# EAGLE design KeyboardSidepanel (EAGLE 7.7.0)
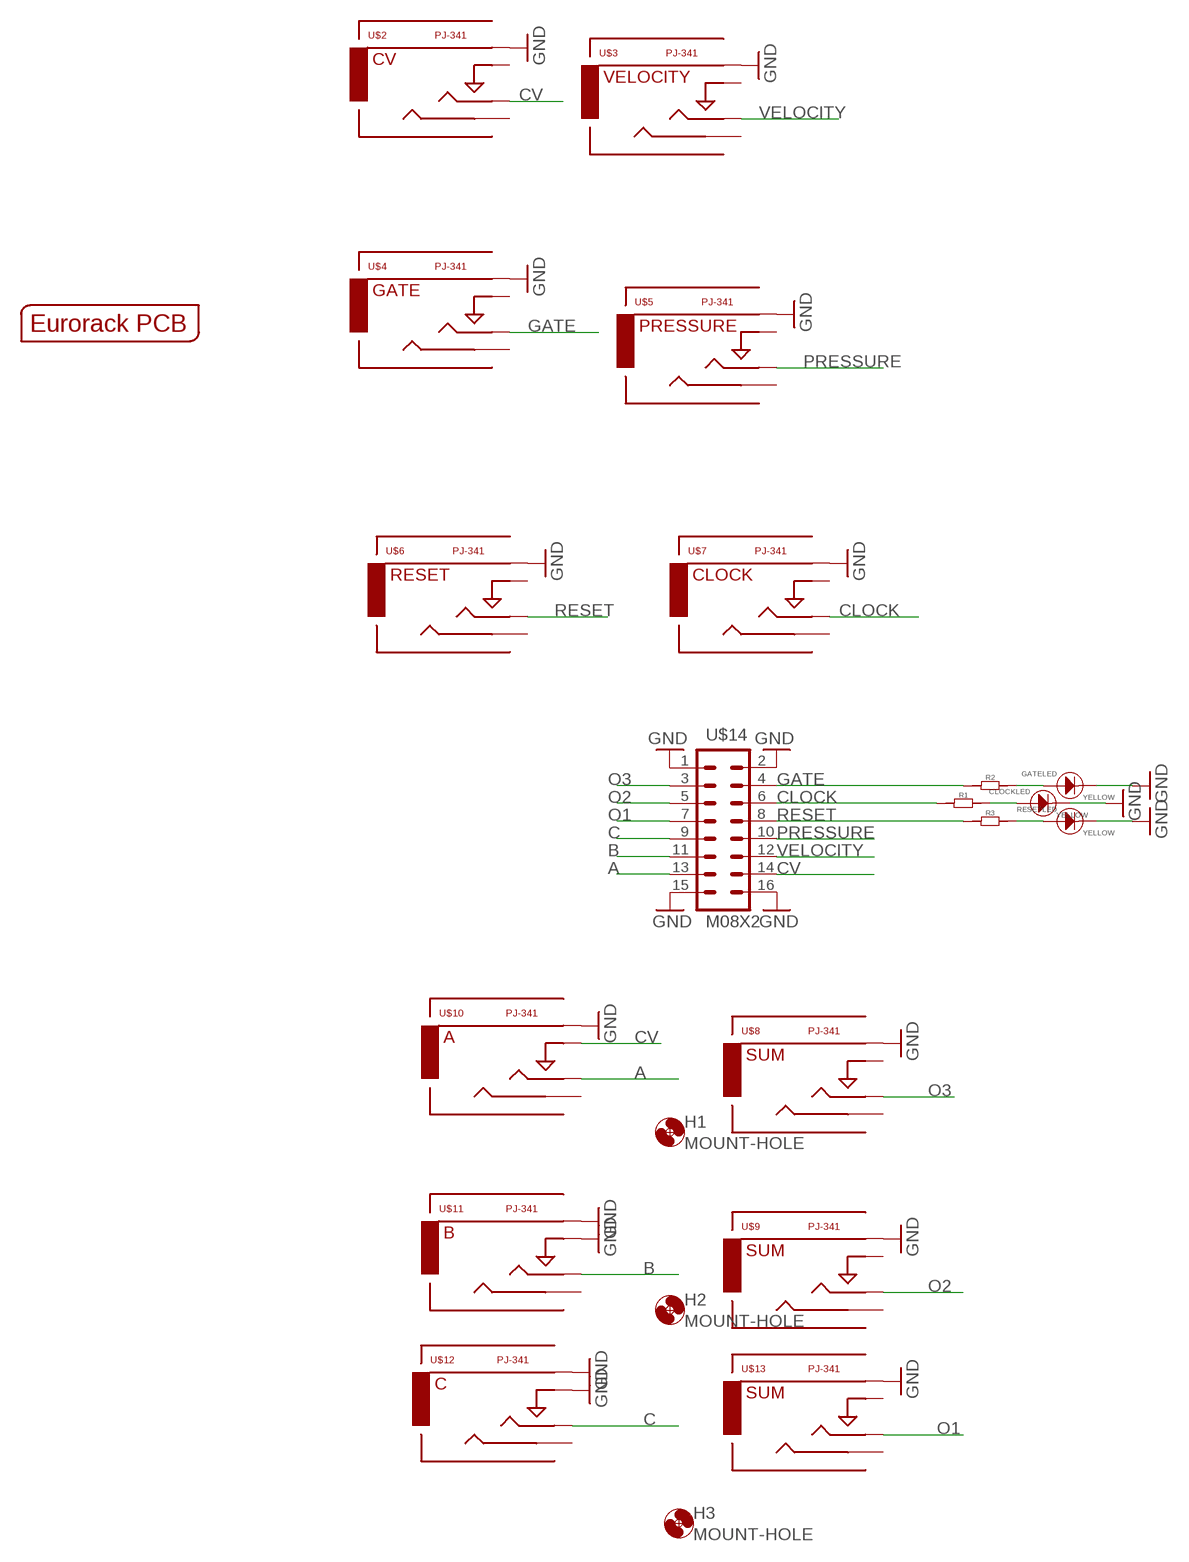
[diagram p0: schematic, sheet 1]

## Parts
CLOCKLED  YELLOW  LED3MM  [3MMLED]
GATELED  YELLOW  LED3MM  [3MMLED]
H1  MOUNT-HOLE  [3.2-NOMARKINGS-SMALLSAFEZONE]
H2  MOUNT-HOLE  [3.2-NOMARKINGS-SMALLSAFEZONE]
H3  MOUNT-HOLE  [3.2-NOMARKINGS-SMALLSAFEZONE]
R1  R-0603  [R0603]
R2  R-0603  [R0603]
R3  R-0603  [R0603]
RESETLED  YELLOW  LED3MM  [3MMLED]
U$1  EURORACK_PCB6HP_10CM  [EURORACK6HPPCB_10CMTALL]
U$2  PJ-341  AUDIO-JACKOUTPUT  [3.5MM-JACK-SWITCH-13MM-OUTPUT]
U$3  PJ-341  AUDIO-JACKOUTPUT  [3.5MM-JACK-SWITCH-13MM-OUTPUT]
U$4  PJ-341  AUDIO-JACKOUTPUT  [3.5MM-JACK-SWITCH-13MM-OUTPUT]
U$5  PJ-341  AUDIO-JACKOUTPUT  [3.5MM-JACK-SWITCH-13MM-OUTPUT]
U$6  PJ-341  AUDIO-JACKOUTPUT  [3.5MM-JACK-SWITCH-13MM-OUTPUT]
U$7  PJ-341  AUDIO-JACKOUTPUT  [3.5MM-JACK-SWITCH-13MM-OUTPUT]
U$8  PJ-341  AUDIO-JACKOUTPUT  [3.5MM-JACK-SWITCH-13MM-OUTPUT]
U$9  PJ-341  AUDIO-JACKOUTPUT  [3.5MM-JACK-SWITCH-13MM-OUTPUT]
U$10  PJ-341  AUDIO-JACKINPUT  [3.5MM-JACK-SWITCH-13MM-INPUT]
U$11  PJ-341  AUDIO-JACKINPUT  [3.5MM-JACK-SWITCH-13MM-INPUT]
U$12  PJ-341  AUDIO-JACKINPUT  [3.5MM-JACK-SWITCH-13MM-INPUT]
U$13  PJ-341  AUDIO-JACKOUTPUT  [3.5MM-JACK-SWITCH-13MM-OUTPUT]
U$14  M08X2  [2X8]

## Nets
A: U$10.TIP@3(TIP) U$14.13
B: U$11.TIP@3(TIP) U$14.11
C: U$12.TIP@3(TIP) U$14.9
CLOCK: R1.1 U$7.TIP@3(TIP) U$14.6
CV: U$2.TIP@3(TIP) U$10.SWITCH@3(SWITCH) U$14.14
GATE: R2.1 U$4.TIP@3(TIP) U$14.4
GND: CLOCKLED.- GATELED.- RESETLED.- U$2.RING@3(RING) U$3.RING@3(RING) U$4.RING@3(RING) U$5.RING@3(RING) U$6.RING@3(RING) U$7.RING@3(RING) U$8.RING@3(RING) U$9.RING@3(RING) U$10.RING@3(RING) U$11.RING@3(RING) U$11.SWITCH@3(SWITCH) U$12.RING@3(RING) U$12.SWITCH@3(SWITCH) U$13.RING@3(RING) U$14.1 U$14.2 U$14.15 U$14.16
N$1: GATELED.+ R2.2
N$2: CLOCKLED.+ R1.2
N$3: R3.2 RESETLED.+
O1: U$13.TIP@3(TIP) U$14.7
O2: U$9.TIP@3(TIP) U$14.5
O3: U$8.TIP@3(TIP) U$14.3
PRESSURE: U$5.TIP@3(TIP) U$14.10
RESET: R3.1 U$6.TIP@3(TIP) U$14.8
VELOCITY: U$3.TIP@3(TIP) U$14.12
Unconnected: U$2.SECOND@3(SECOND) U$2.SWITCH@3(SWITCH) U$3.SECOND@3(SECOND) U$3.SWITCH@3(SWITCH) U$4.SECOND@3(SECOND) U$4.SWITCH@3(SWITCH) U$5.SECOND@3(SECOND) U$5.SWITCH@3(SWITCH) U$6.SECOND@3(SECOND) U$6.SWITCH@3(SWITCH) U$7.SECOND@3(SECOND) U$7.SWITCH@3(SWITCH) U$8.SECOND@3(SECOND) U$8.SWITCH@3(SWITCH) U$9.SECOND@3(SECOND) U$9.SWITCH@3(SWITCH) U$10.SECOND@3(SECOND) U$11.SECOND@3(SECOND) U$12.SECOND@3(SECOND) U$13.SECOND@3(SECOND) U$13.SWITCH@3(SWITCH)

## Library data of the parts
CLOCKLED GATELED RESETLED = EurorackModularParts:LED*: LED
H1-H3 = zephod-components:MOUNT-HOLE: MOUNTING HOLE with drill center marker
R1-R3 = OPL:R*
U$1 = EurorackModularParts:EURORACK_PCB
U$2 = EurorackModularParts:AUDIO-JACK: Switching Mono 3.5mm Audio Jack from Erthenvar.; DESC: CV; MPN: PJ-341
U$3 = EurorackModularParts:AUDIO-JACK: Switching Mono 3.5mm Audio Jack from Erthenvar.; DESC: VELOCITY; MPN: PJ-341
U$4 = EurorackModularParts:AUDIO-JACK: Switching Mono 3.5mm Audio Jack from Erthenvar.; DESC: GATE; MPN: PJ-341
U$5 = EurorackModularParts:AUDIO-JACK: Switching Mono 3.5mm Audio Jack from Erthenvar.; DESC: PRESSURE; MPN: PJ-341
U$6 = EurorackModularParts:AUDIO-JACK: Switching Mono 3.5mm Audio Jack from Erthenvar.; DESC: RESET; MPN: PJ-341
U$7 = EurorackModularParts:AUDIO-JACK: Switching Mono 3.5mm Audio Jack from Erthenvar.; DESC: CLOCK; MPN: PJ-341
U$8 U$9 U$13 = EurorackModularParts:AUDIO-JACK: Switching Mono 3.5mm Audio Jack from Erthenvar.; DESC: SUM; MPN: PJ-341
U$10 = EurorackModularParts:AUDIO-JACK: Switching Mono 3.5mm Audio Jack from Erthenvar.; DESC: A; MPN: PJ-341
U$11 = EurorackModularParts:AUDIO-JACK: Switching Mono 3.5mm Audio Jack from Erthenvar.; DESC: B; MPN: PJ-341
U$12 = EurorackModularParts:AUDIO-JACK: Switching Mono 3.5mm Audio Jack from Erthenvar.; DESC: C; MPN: PJ-341
U$14 = SparkFun-Connectors:M08X2: .1" headers, two rows of 8 each

## Net classes
0 default: width 0.254 mm

## Board
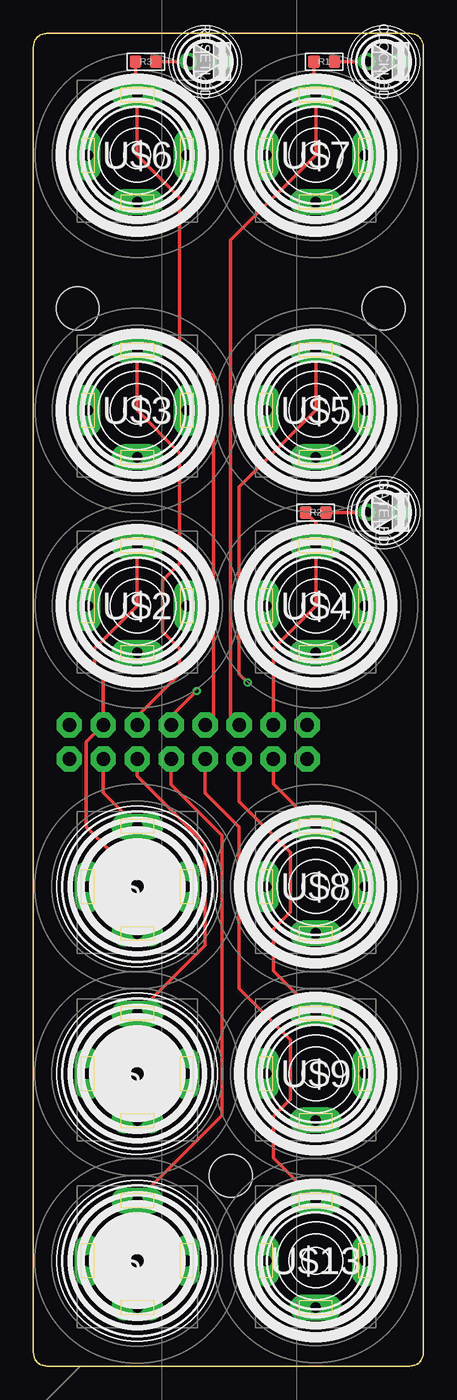
[diagram p1: board, top side]
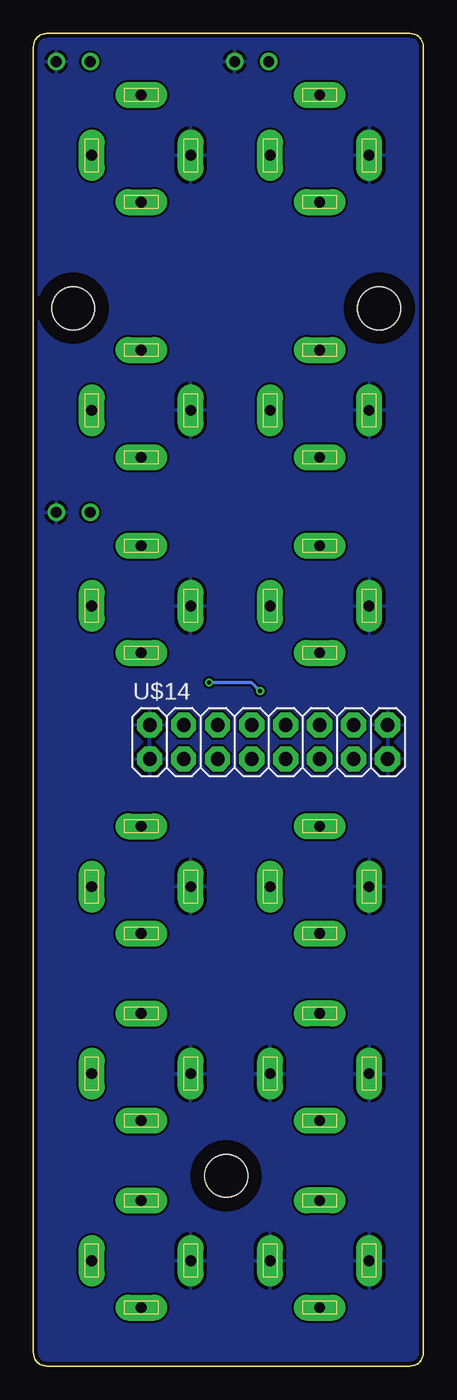
[diagram p2: board, bottom side, seen from below]

Size 29.14 x 99.5 mm. Coordinates in mm from the lower left corner, seen from the top.
Copper layers (1*16): Top 0.035mm / dielectric 1.5mm / Bottom 0.035mm
Design rules "ITEADstudio_DRC": minimum track width 6mil, minimum drill 12mil, track to track 6mil, track to pad 6mil, pad to pad 6mil, via to via 6mil, smd to smd 0mil, copper to edge 10mil, drill to drill 10mil, minimum pad ring 10mil, minimum via ring 6mil, stop-mask expansion 2mil, vias tented up to drill 100mil, thermal gap 10mil

### Footprints (pad centres in the part's own frame; a part is rotated, then mirrored left to right if it is on the bottom)
3MMLED = drill 0.8: + -1.27,0; - 1.27,0
3.2-NOMARKINGS-SMALLSAFEZONE = hole 3.2: 0,0
R0603 = smd 0.889 x 0.889: 1 -0.762,0; 2 0.762,0
3.5MM-JACK-SWITCH-13MM-OUTPUT = drill 0.8 pad 1.93 long: RING@3 -3.7,0; SECOND@3 0,-3.5; SWITCH@3 3.7,0; TIP@3 0,4.5
3.5MM-JACK-SWITCH-13MM-INPUT = drill 0.8 pad 1.93 long: RING@3 -3.7,0; SECOND@3 0,-3.5; SWITCH@3 3.7,0; TIP@3 0,4.5
2X8 = drill 1.016 pad 1.88 octagon: 1 0,0; 2 0,2.54; 3 2.54,0; 4 2.54,2.54; 5 5.08,0; 6 5.08,2.54; 7 7.62,0; 8 7.62,2.54; 9 10.16,0; 10 10.16,2.54; 11 12.7,0; 12 12.7,2.54; 13 15.24,0; 14 15.24,2.54; 15 17.78,0; 16 17.78,2.54

### Placement (x,y rotation side)
CLOCKLED  26.17,97.39 0 top
GATELED  26.17,63.74 0 top
H1  14.74,14.21 0 top
H2  3.31,78.98 0 top
H3  26.17,78.98 0 top
R1  21.73,97.39 0 top
R2  21.09,63.74 0 top
R3  8.39,97.39 0 top
RESETLED  12.84,97.39 0 top
U$1  -0.5,-15 0 top  (outside the outline)
U$2  7.76,56.75 0 top
U$3  7.76,71.36 0 top
U$4  21.09,56.75 0 top
U$5  21.09,71.36 0 top
U$6  7.76,90.41 0 top
U$7  21.09,90.41 0 top
U$8  21.09,35.8 0 top
U$9  21.09,21.83 0 top
U$10  7.76,35.8 0 top
U$11  7.76,21.83 0 top
U$12  7.76,7.86 0 top
U$13  21.09,7.86 0 top
U$14  20.45,45.33 0 bottom

### Tracks (layer width: path | path; a pad name or v marks a point on that pad's centre or on a via)
A
  Top 0.254: U$14.13 5.21,42.84 U$10.TIP@3
B
  Top 0.254: U$14.11 7.76,44.05 12.84,38.98 12.84,31.41 U$11.TIP@3
C
  Top 0.254: U$14.9 10.29,43.42 14.11,39.61 14.11,18.71 U$12.TIP@3
CLOCK
  Top 0.254: R1.1 20.96,95.04 U$7.TIP@3 21.09,90.41 14.74,84.06 14.74,48.5 U$14.6
CV
  Top 0.254: U$2.TIP@3 7.76,56.75 4.58,53.58 4.58,52.31 5.21,51.67 U$14.14 3.95,46.59 3.95,40.24 5.85,38.34 8.91,38.34 U$10.SWITCH@3
GATE
  Top 0.254: U$14.4 17.91,53.58 21.09,56.75 U$4.TIP@3 21.09,62.98 R2.1
GND
  pour Bottom: -1.14,101.2 29.25,101.2 arc-90 32.52,99.2 32.52,-4.21 0.86,-4.21 arc-90 -1.14,-2.21
N$1
  Top 0.254: R2.2 GATELED.+
N$2
  Top 0.254: R1.2 CLOCKLED.+
N$3
  Top 0.254: R3.2 RESETLED.+
O1
  Top 0.254: U$14.7 12.84,42.78 15.38,40.24 15.38,28.18 19.18,24.37 19.18,19.92 17.91,18.66 17.91,15.54 U$13.TIP@3
O2
  Top 0.254: U$14.5 15.38,42.15 19.18,38.34 19.18,33.9 17.91,32.62 17.91,29.51 U$9.TIP@3
O3
  Top 0.254: U$14.3 17.91,43.48 U$8.TIP@3
PRESSURE  (via drill 0.3)
  Top 0.254: U$5.TIP@3 21.09,71.36 15.38,65.64 15.38,51.67 v16.01,51.04 | v12.2,50.41 10.29,48.5 U$14.10
  Bottom 0.254: v16.01,51.04 12.84,51.04 v12.2,50.41
RESET
  Top 0.254: R3.1 7.63,95.04 U$6.TIP@3 7.76,90.41 10.93,87.23 10.93,76.44 13.47,73.9 13.47,48.5 U$14.8
VELOCITY
  Top 0.254: U$14.12 7.76,48.5 10.93,51.67 10.93,53.58 9.66,54.85 9.66,58.66 10.93,59.93 10.93,68.19 7.76,71.36 U$3.TIP@3